# Altium project Remote Base.PrjPcb
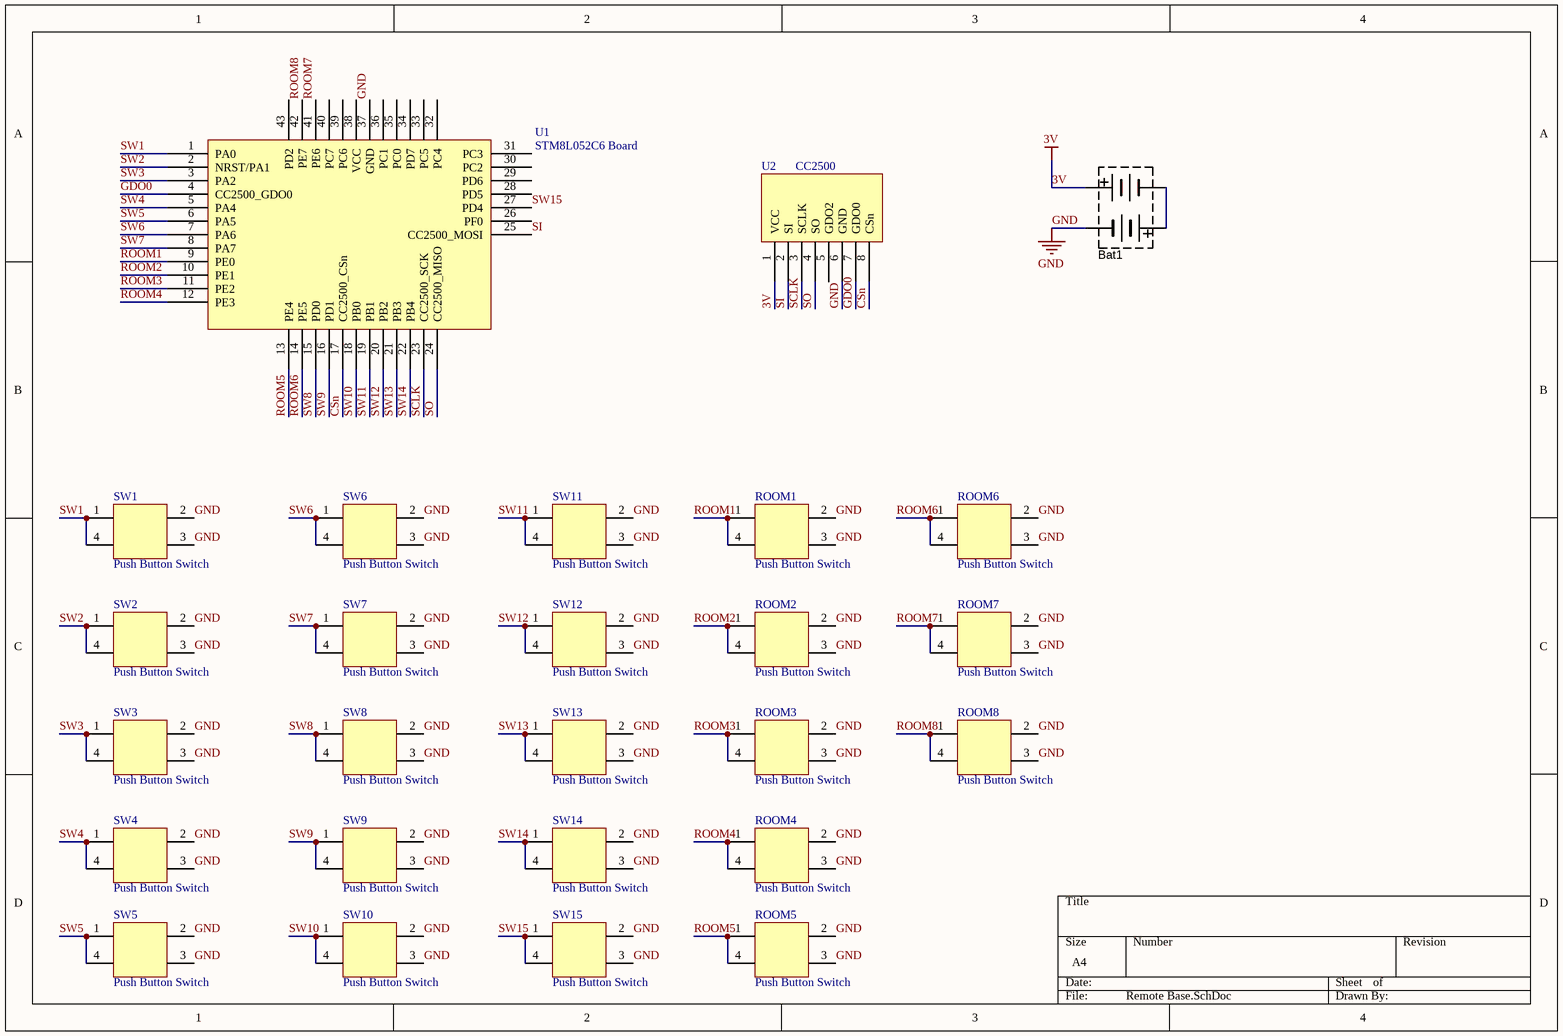
[diagram p0: Remote Base.SchDoc]
1 sheet, 26 parts. Net scope: global (net labels, ports and power ports of the same name join across sheets).
Board file: Remote Base.PcbDoc

## Sheet Remote Base.SchDoc
size A4

### Parts
Bat1  NiMH-AA x 2  [BATT_HOLDER_2XAA]  (value not drawn)
ROOM1  Push Button Switch  [Push Button Switch]
ROOM2  Push Button Switch  [Push Button Switch]
ROOM3  Push Button Switch  [Push Button Switch]
ROOM4  Push Button Switch  [Push Button Switch]
ROOM5  Push Button Switch  [Push Button Switch]
ROOM6  Push Button Switch  [Push Button Switch]
ROOM7  Push Button Switch  [Push Button Switch]
ROOM8  Push Button Switch  [Push Button Switch]
SW1  Push Button Switch  [Push Button Switch]
SW2  Push Button Switch  [Push Button Switch]
SW3  Push Button Switch  [Push Button Switch]
SW4  Push Button Switch  [Push Button Switch]
SW5  Push Button Switch  [Push Button Switch]
SW6  Push Button Switch  [Push Button Switch]
SW7  Push Button Switch  [Push Button Switch]
SW8  Push Button Switch  [Push Button Switch]
SW9  Push Button Switch  [Push Button Switch]
SW10  Push Button Switch  [Push Button Switch]
SW11  Push Button Switch  [Push Button Switch]
SW12  Push Button Switch  [Push Button Switch]
SW13  Push Button Switch  [Push Button Switch]
SW14  Push Button Switch  [Push Button Switch]
SW15  Push Button Switch  [Push Button Switch]
U1  STM8L052C6 Board  [STM8L052C6 BOARD]
U2  CC2500  [CC2500]

### Nets
3V: Bat1.C1+ U2.1(VCC)
GND: Bat1.C2- ROOM1.2 ROOM1.3 ROOM2.2 ROOM2.3 ROOM3.2 ROOM3.3 ROOM4.2 ROOM4.3 ROOM5.2 ROOM5.3 ROOM6.2 ROOM6.3 ROOM7.2 ROOM7.3 ROOM8.2 ROOM8.3 SW1.2 SW1.3 SW2.2 SW2.3 SW3.2 SW3.3 SW4.2 SW4.3 SW5.2 SW5.3 SW6.2 SW6.3 SW7.2 SW7.3 SW8.2 SW8.3 SW9.2 SW9.3 SW10.2 SW10.3 SW11.2 SW11.3 SW12.2 SW12.3 SW13.2 SW13.3 SW14.2 SW14.3 SW15.2 SW15.3 U1.37(GND) U2.6(GND)
CSn: U1.17(CC2500_CSn) U2.8(CSn)
GDO0: U1.4(CC2500_GDO0) U2.7(GDO0)
ROOM1: ROOM1.1 ROOM1.4 U1.9(PE0)
ROOM2: ROOM2.1 ROOM2.4 U1.10(PE1)
ROOM3: ROOM3.1 ROOM3.4 U1.11(PE2)
ROOM4: ROOM4.1 ROOM4.4 U1.12(PE3)
ROOM5: ROOM5.1 ROOM5.4 U1.13(PE4)
ROOM6: ROOM6.1 ROOM6.4 U1.14(PE5)
ROOM7: ROOM7.1 ROOM7.4 U1.41(PE6)
ROOM8: ROOM8.1 ROOM8.4 U1.42(PE7)
SCLK: U1.23(CC2500_SCK) U2.3(SCLK)
SI: U1.25(CC2500_MOSI) U2.2(SI)
SO: U1.24(CC2500_MISO) U2.4(SO)
SW1: SW1.1 SW1.4 U1.1(PA0)
SW2: SW2.1 SW2.4 U1.2(NRST/PA1)
SW3: SW3.1 SW3.4 U1.3(PA2)
SW4: SW4.1 SW4.4 U1.5(PA4)
SW5: SW5.1 SW5.4 U1.6(PA5)
SW6: SW6.1 SW6.4 U1.7(PA6)
SW7: SW7.1 SW7.4 U1.8(PA7)
SW8: SW8.1 SW8.4 U1.15(PD0)
SW9: SW9.1 SW9.4 U1.16(PD1)
SW10: SW10.1 SW10.4 U1.18(PB0)
SW11: SW11.1 SW11.4 U1.19(PB1)
SW12: SW12.1 SW12.4 U1.20(PB2)
SW13: SW13.1 SW13.4 U1.21(PB3)
SW14: SW14.1 SW14.4 U1.22(PB4)
SW15: SW15.1 SW15.4 U1.27(PD4)
NetBat1_C1-: Bat1.C1- Bat1.C2+

Not connected (* = marked no-connect by the designer): U1 26(PF0) 28(PD5) 29(PD6) 30(PC2) 31(PC3) 32(PC4) 33(PC5) 34(PD7) 35(PC0) 36(PC1) 38(VCC) 39(PC6) 40(PC7) 43(PD2); U2 5(GDO2)

### Library data of the parts
Bat1 = BATT_AAx2_Holder: Battery holder 2xAA PCB mount; Manufacturer 1: MPD (Memory Protection Devices); Manufacturer Part Number 1: BK-6100-PC4; Ratings: 1300 mAh; Battery Type, Function: Cylindrical, Holder; Style: Holder (Open); Battery Cell Size: AA; Number of Cells: 2; Package / Case: per dwg; Supplier 1: Digi-Key; Supplier Part Number 1: BK-6100-PC4-ND; Mounting Type: PCB, Through Hole; Height Above Board: 0.657" (16.69mm); ComponentLink1URL: http://www.memoryprotectiondevices.com/datasheets/BK-6100-PC4-datasheet.pdf; ComponentLink1Description: http://www.memoryprotectiondevices.com/datasheets/BK-6100-PC4-datasheet.pdf